# EAGLE design Grove - 3-Axis Digital Accelerometer(±16g) v1.3 (EAGLE 6.4)
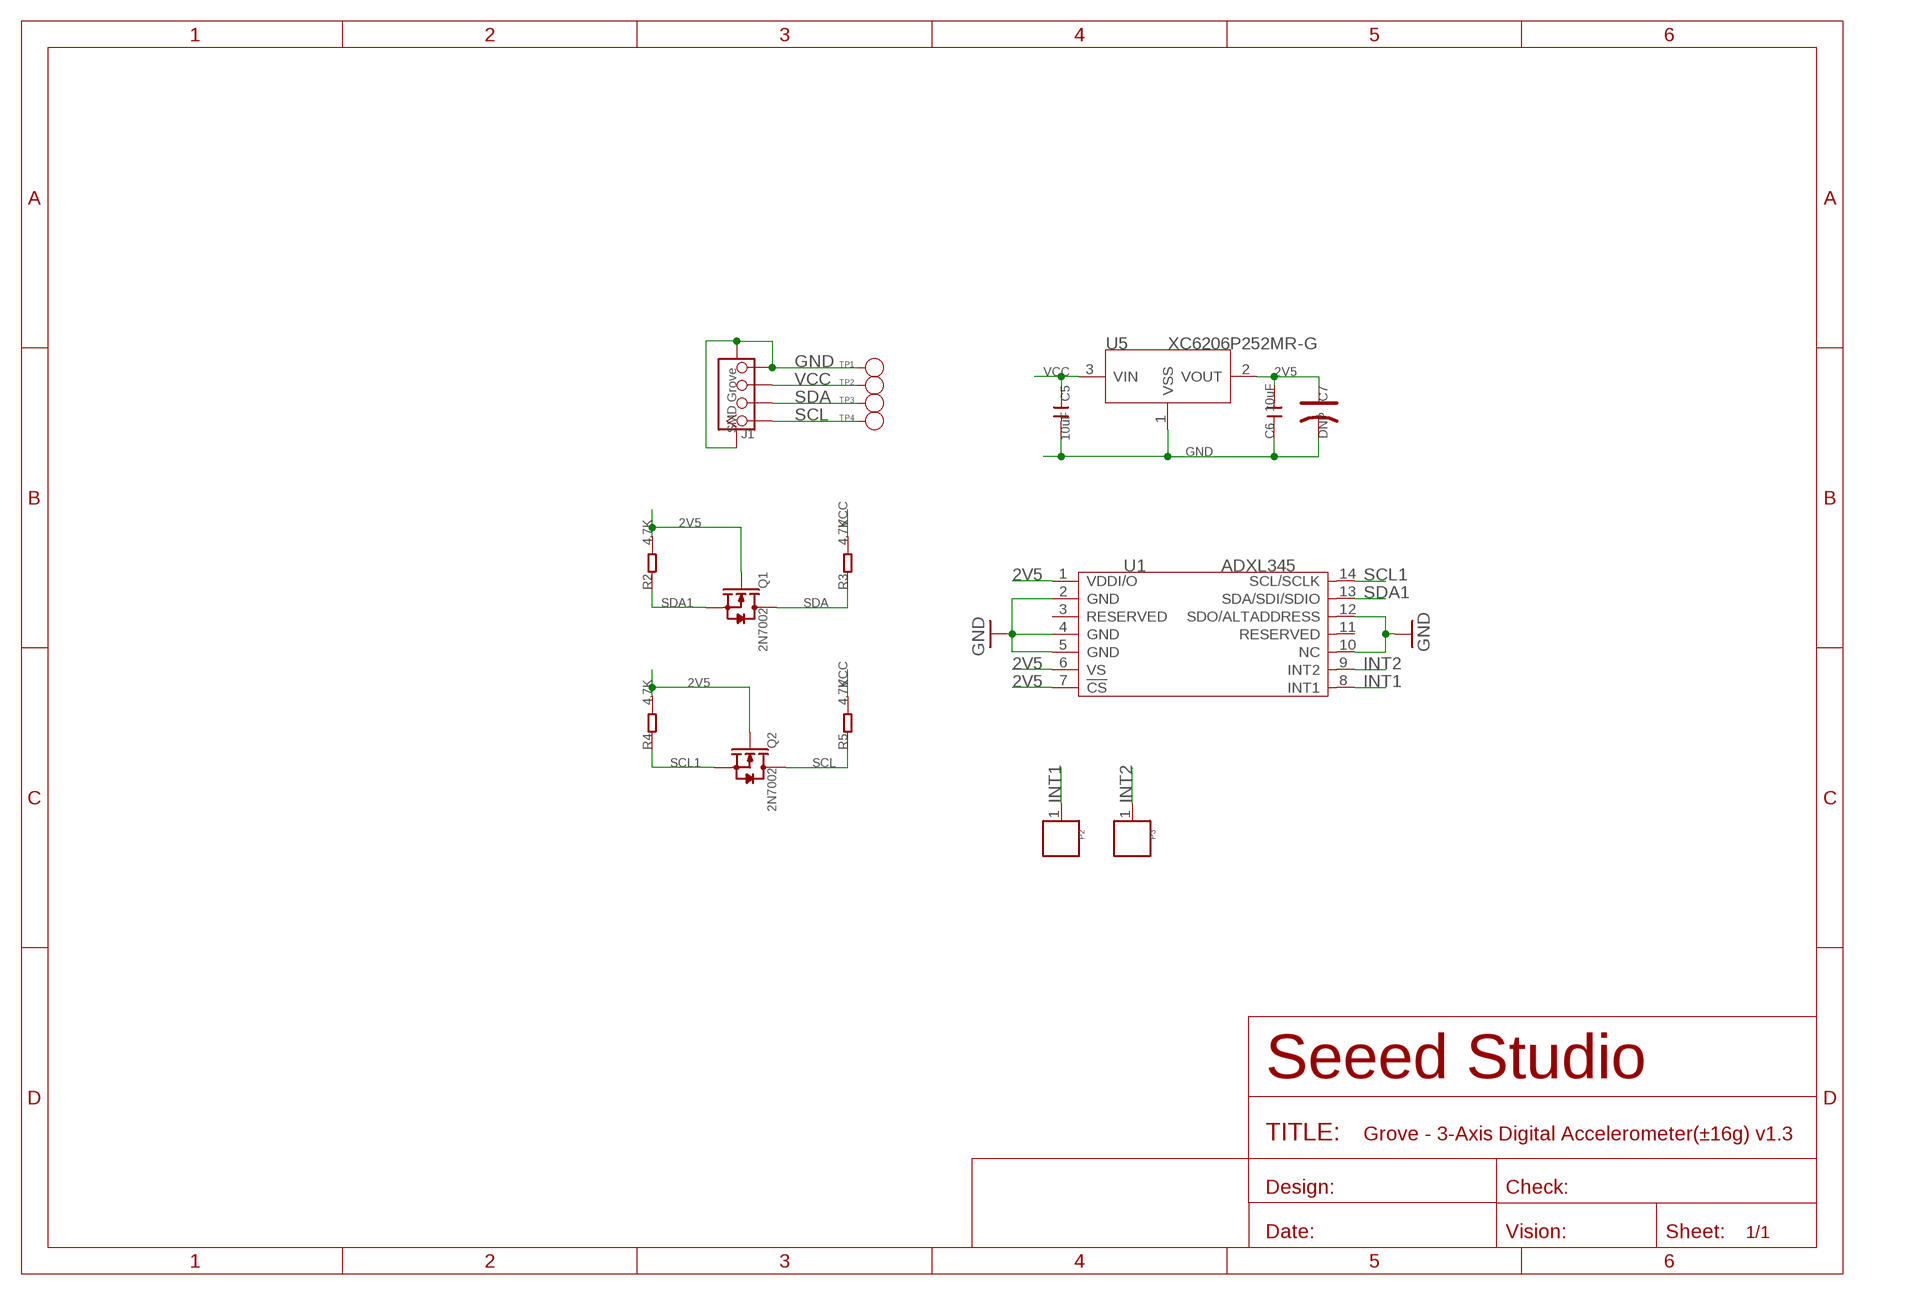
[diagram p0: schematic, sheet 1]

## Parts
C5  10uF  C-0805  [C0805]
C6  10uF  C-0805  [C0805]
C7  DNP  CAP-AVX-A  [AVX-A]
J1  SMD Grove  TWIG-4P-2.0-SMD-FEMALE-REINFORCE'DD'  [4P-SMD-2.0]
P2  DNP  PAD'60/30'  [1P-65/35MIL]
P3  DNP  PAD'60/30'  [1P-65/35MIL]
Q1  2N7002  MOSFET-N'SOT23'  [SOT23]
Q2  2N7002  MOSFET-N'SOT23'  [SOT23]
R2  4.7K  R-0603  [R0603]
R3  4.7K  R-0603  [R0603]
R4  4.7K  R-0603  [R0603]
R5  4.7K  R-0603  [R0603]
TP1  PAD-TEST-POINT'4545'  [TP_4545]
TP2  PAD-TEST-POINT'4545'  [TP_4545]
TP3  PAD-TEST-POINT'4545'  [TP_4545]
TP4  PAD-TEST-POINT'4545'  [TP_4545]
U1  ADXL345  [LGA14]
U5  XC6206P252MR-G  XC6206MR  [SOT23]

## Nets
2V5: C6.2 C7.+ Q1.1(G) Q2.1(G) R2.2 R4.2 U1.1(VDDI/O) U1.6(VS) U1.7(!CS) U5.2(VOUT)
GND: C5.2 C6.1 C7.- J1.4 J1.SS1 J1.SS2 TP1.T U1.2(GND) U1.4(GND) U1.5(GND) U1.10(NC) U1.12(SDO/ALTADDRESS) U5.1(VSS)
INT1: P2.1 U1.8(INT1)
INT2: P3.1 U1.9(INT2)
SCL: J1.1 Q2.3(D) R5.1 TP4.T
SCL1: Q2.2(S) R4.1 U1.14(SCL/SCLK)
SDA: J1.2 Q1.3(D) R3.1 TP3.T
SDA1: Q1.2(S) R2.1 U1.13(SDA/SDI/SDIO)
VCC: C5.1 J1.3 R3.2 R5.2 TP2.T U5.3(VIN)
Unconnected: U1.3(RESERVED) U1.11(RESERVED)

## Library data of the parts
C5 C6 = Discrete:C*: Ceramic Capacitors
C7 = Discrete:CAP*: Electrolytic Capacitors,Tantalum Capacitors and Super Capacitors
J1 = Connector:TWIG-4P-2.0-SMD-FEMALE-REINFORCE
P2 P3 = Discrete:PAD
Q1 Q2 = Discrete:MOSFET-N: IRLL014: http://www.vishay.com/docs/91319/sihll014.pdf
R2-R5 = Discrete:R*
TP1-TP4 = Discrete:PAD-TEST-POINT; PARTNO: DNP
U1 = IC:ADXL345: 3-Axis,+/-2g / +/-4g / +/-8g / +/-16g Digital Accelerometer
U5 = IC:XC6206: LOW ESR Cap.Compatible Positive Voltage Regulators

## Board
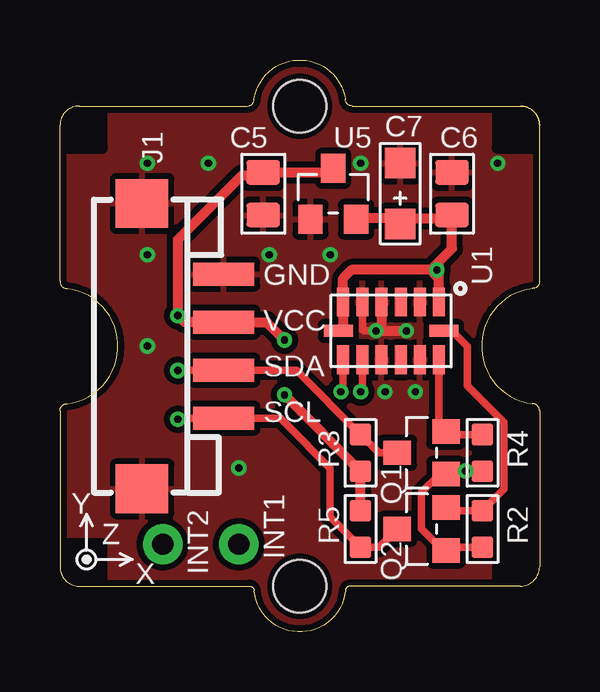
[diagram p1: board, top side]
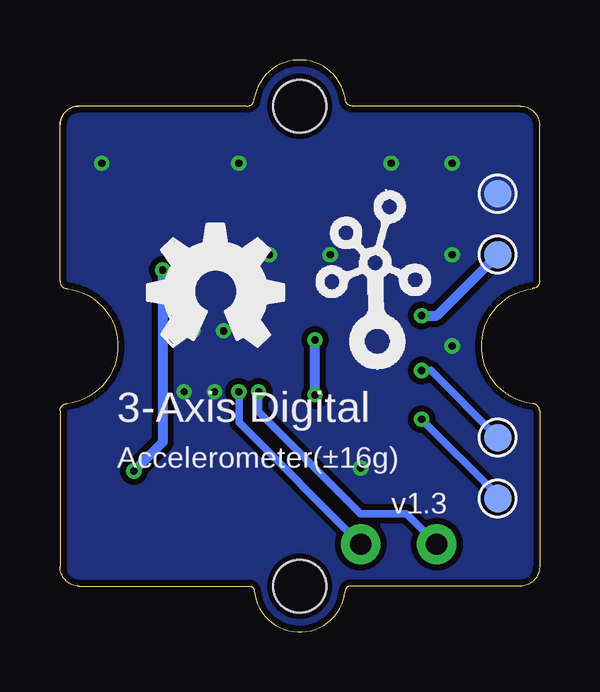
[diagram p2: board, bottom side, seen from below]

Size 20 x 23.83 mm. Coordinates in mm from the lower left corner, seen from the top.
Copper layers (1*16): Top 0.035mm / dielectric 1.5mm / Bottom 0.035mm
Design rules "SeeedStudio_2layer_DRU_no_angle_20140221 *": minimum track width 6mil, minimum drill 12mil, track to track 6mil, track to pad 6mil, pad to pad 6mil, via to via 6mil, smd to smd 0mil, copper to edge 10mil, drill to drill 10mil, minimum pad ring 10mil, minimum via ring 6mil, stop-mask expansion 2mil, vias tented up to drill 100mil, thermal gap 10mil
tRestrict: area 12.9,13.3 to 13.1,14.2

### Footprints (pad centres in the part's own frame; a part is rotated, then mirrored left to right if it is on the bottom)
C0805 = smd 1.016 x 1.397: 1 -0.889,0; 2 0.889,0
AVX-A = smd 1.27 x 1.27: + -1.27,0; - 1.27,0
4P-SMD-2.0 = smd 0.965 x 2.54: 1 -3,0; 2 -1,0; 3 1,0; 4 3,0 | smd 2.032 x 2.184: SS1 -5.946,3.4; SS2 5.946,3.4
1P-65/35MIL = drill 0.889 pad 1.651: 1 0,0
SOT23 = smd 1.016 x 1.143: 1 -0.889,-1.016; 2 0.889,-1.016; 3 0,1.016
R0603 = smd 0.889 x 0.889: 1 -0.762,0; 2 0.762,0
TP_4545 = smd 1.143 x 1.143: T 0,0
LGA14 = smd 1.2 x 0.5: 1 -1.2,2; 2 -1.2,1.2; 3 -1.2,0.4; 4 -1.2,-0.4; 5 -1.2,-1.2; 6 -1.2,-2; 8 1.2,-2; 9 1.2,-1.2; 10 1.2,-0.4; 11 1.2,0.4; 12 1.2,1.2; 13 1.2,2 | smd 0.5 x 1.2: 7 0,-2.2; 14 0,2.2
SOT23' = smd 1.016 x 1.2: 1 -0.95,-1.06; 2 0.95,-1.06; 3 0,1.06
1U-DIM-W/-DRILL = hole 2.2: 0,-10; 0,10

### Placement (x,y rotation side)
C5  8.48,18.26 270 top
C6  16.35,18.26 270 top
C7  14.19,18.26 90 top
J1  6.83,11.91 90 top
P2  4.29,3.65 270 top
P3  7.46,3.65 270 top
Q1  15.08,7.46 90 top
Q2  15.08,4.29 90 top
R2  17.62,7.46 270 top
R3  12.54,7.46 270 top
R4  17.62,4.29 270 top
R5  12.54,4.29 90 top
TP1  1.74,18.26 0 bottom
TP2  1.74,15.72 0 bottom
TP3  1.74,8.1 0 bottom
TP4  1.74,5.56 0 bottom
U1  13.81,12.54 270 top
U5  XC6206P252MR-G  [SOT23']  11.4,18.26 0 top
U$1  [OSHW_FILLX200_NOTEXT]  16.35,11.91 0 bottom
U$3  [TWIGLOGO]  6.83,11.91 0 bottom
U$4  [1U-DIM-W/-DRILL]  10,11.91 0 top

### Tracks (layer width: path | path; a pad name or v marks a point on that pad's centre or on a via)
2V5  (via drill 0.3 pad 0.64)
  Top 0.305: R2.2 v16.92,6.7 16.1,6.7 | R4.2 16.22,3.53 Q2.1 | 15.97,3.4 15.08,4.29 15.08,5.81 15.84,6.57 15.97,6.57 Q1.1
  Top 0.406: 15.81,15.43 U1.1 15.81,14.99 v15.71,15.08 15.46,15.08 | U5.2 12.26,17.24 13.81,17.24 C7.+ 14.06,17.24 16.35,17.24 C6.2 16.35,15.97 15.81,15.43 | 15.46,15.08 12.16,15.08 11.81,14.73 U1.6 11.81,12.64 11.9,12.54 U1.7 | 15.81,15.43 15.46,15.08 | 15.46,15.08 15.71,14.83 | Q2.1 15.97,3.4 | 15.84,6.83 15.97,6.7 | 15.97,6.7 15.97,6.57 | 15.97,6.7 16.1,6.7
  Bottom 0.406: v15.71,15.08 15.71,7.91 v16.92,6.7
GND  (via drill 0.3 pad 0.64)
  Top 0.305: U1.5 12.61,12.6 12.67,12.54 v13.18,12.54
  Top 0.406: v13.18,12.54 13.43,12.54 | 13.43,12.54 v14.45,12.54 | U1.4 13.41,12.56 13.43,12.54
  other vias: 13.56,10 14.83,10 12.54,19.53 18.26,19.53 8.73,15.72 11.27,15.72 6.19,19.53 3.65,19.53 3.65,15.72 3.65,11.91 7.46,6.83
  pour Bottom (isolate 0.254): -0.79,24.61 20.8,24.61 20.8,-0.79 -0.79,-0.79
  pour Top (isolate 0.254): -0.79,24.61 20.8,24.61 20.8,-0.79 -0.79,-0.79
INT1  (via drill 0.3 pad 0.64)
  Top 0.305: U1.8 11.81,10.1 v11.71,10
  Bottom 0.305: v11.71,10 11.71,9.18 7.46,4.92 5.55,4.92 P2.1
INT2  (via drill 0.3 pad 0.64)
  Top 0.305: U1.9 12.61,10.07 v12.54,10
  Bottom 0.305: v12.54,10 12.54,8.73 P3.1
SCL  (via drill 0.3 pad 0.64)
  Top 0.305: Q2.3 13.3,3.53 R5.1 11.27,4.8 11.27,6.83 9.43,8.67 9.37,8.73 9.19,8.91 J1.1 4.97,8.91 v4.92,8.86
  Bottom 0.305: TP4.T 1.74,5.69 v4.92,8.86
SCL1
  Top 0.305: Q2.2 16.22,5.05 R4.1 18.51,5.94 18.51,8.73 16.98,10.26 16.98,11.91 16.35,12.54 U1.14
SDA  (via drill 0.3 pad 0.64)
  Top 0.305: v4.92,10.89 4.94,10.91 J1.2 9.86,10.91 R3.1 13.3,7.46 Q1.3
  Bottom 0.305: v4.92,10.89 4.54,10.89 TP3.T
SDA1
  Top 0.305: U1.13 15.81,8.38 15.97,8.23 | R2.1 16.22,8.23 Q1.2
  Top 0.406: Q1.2 15.97,8.23
VCC  (via drill 0.3 pad 0.64)
  Top 0.406: 11.14,19.15 U5.3 11.4,19.15 C5.1 8.48,19.02 7.59,19.02 4.92,16.35 v4.92,13.18 5.19,12.91 J1.3 8.62,12.91 v9.37,12.16 | R5.2 R3.2 v9.37,9.88
  Bottom 0.406: v4.92,13.18 4.29,13.18 TP2.T | v9.37,9.88 v9.37,12.16

### Text on the board
tPlace: GND | VCC | SDA | SCL
bPlace: 3-Axis Digital | Accelerometer(±16g) | v1.3
tNames: Y | Z | INT1 | X | INT2